# Altium schematic sheet 18 4  第一版.SchDoc
size A1
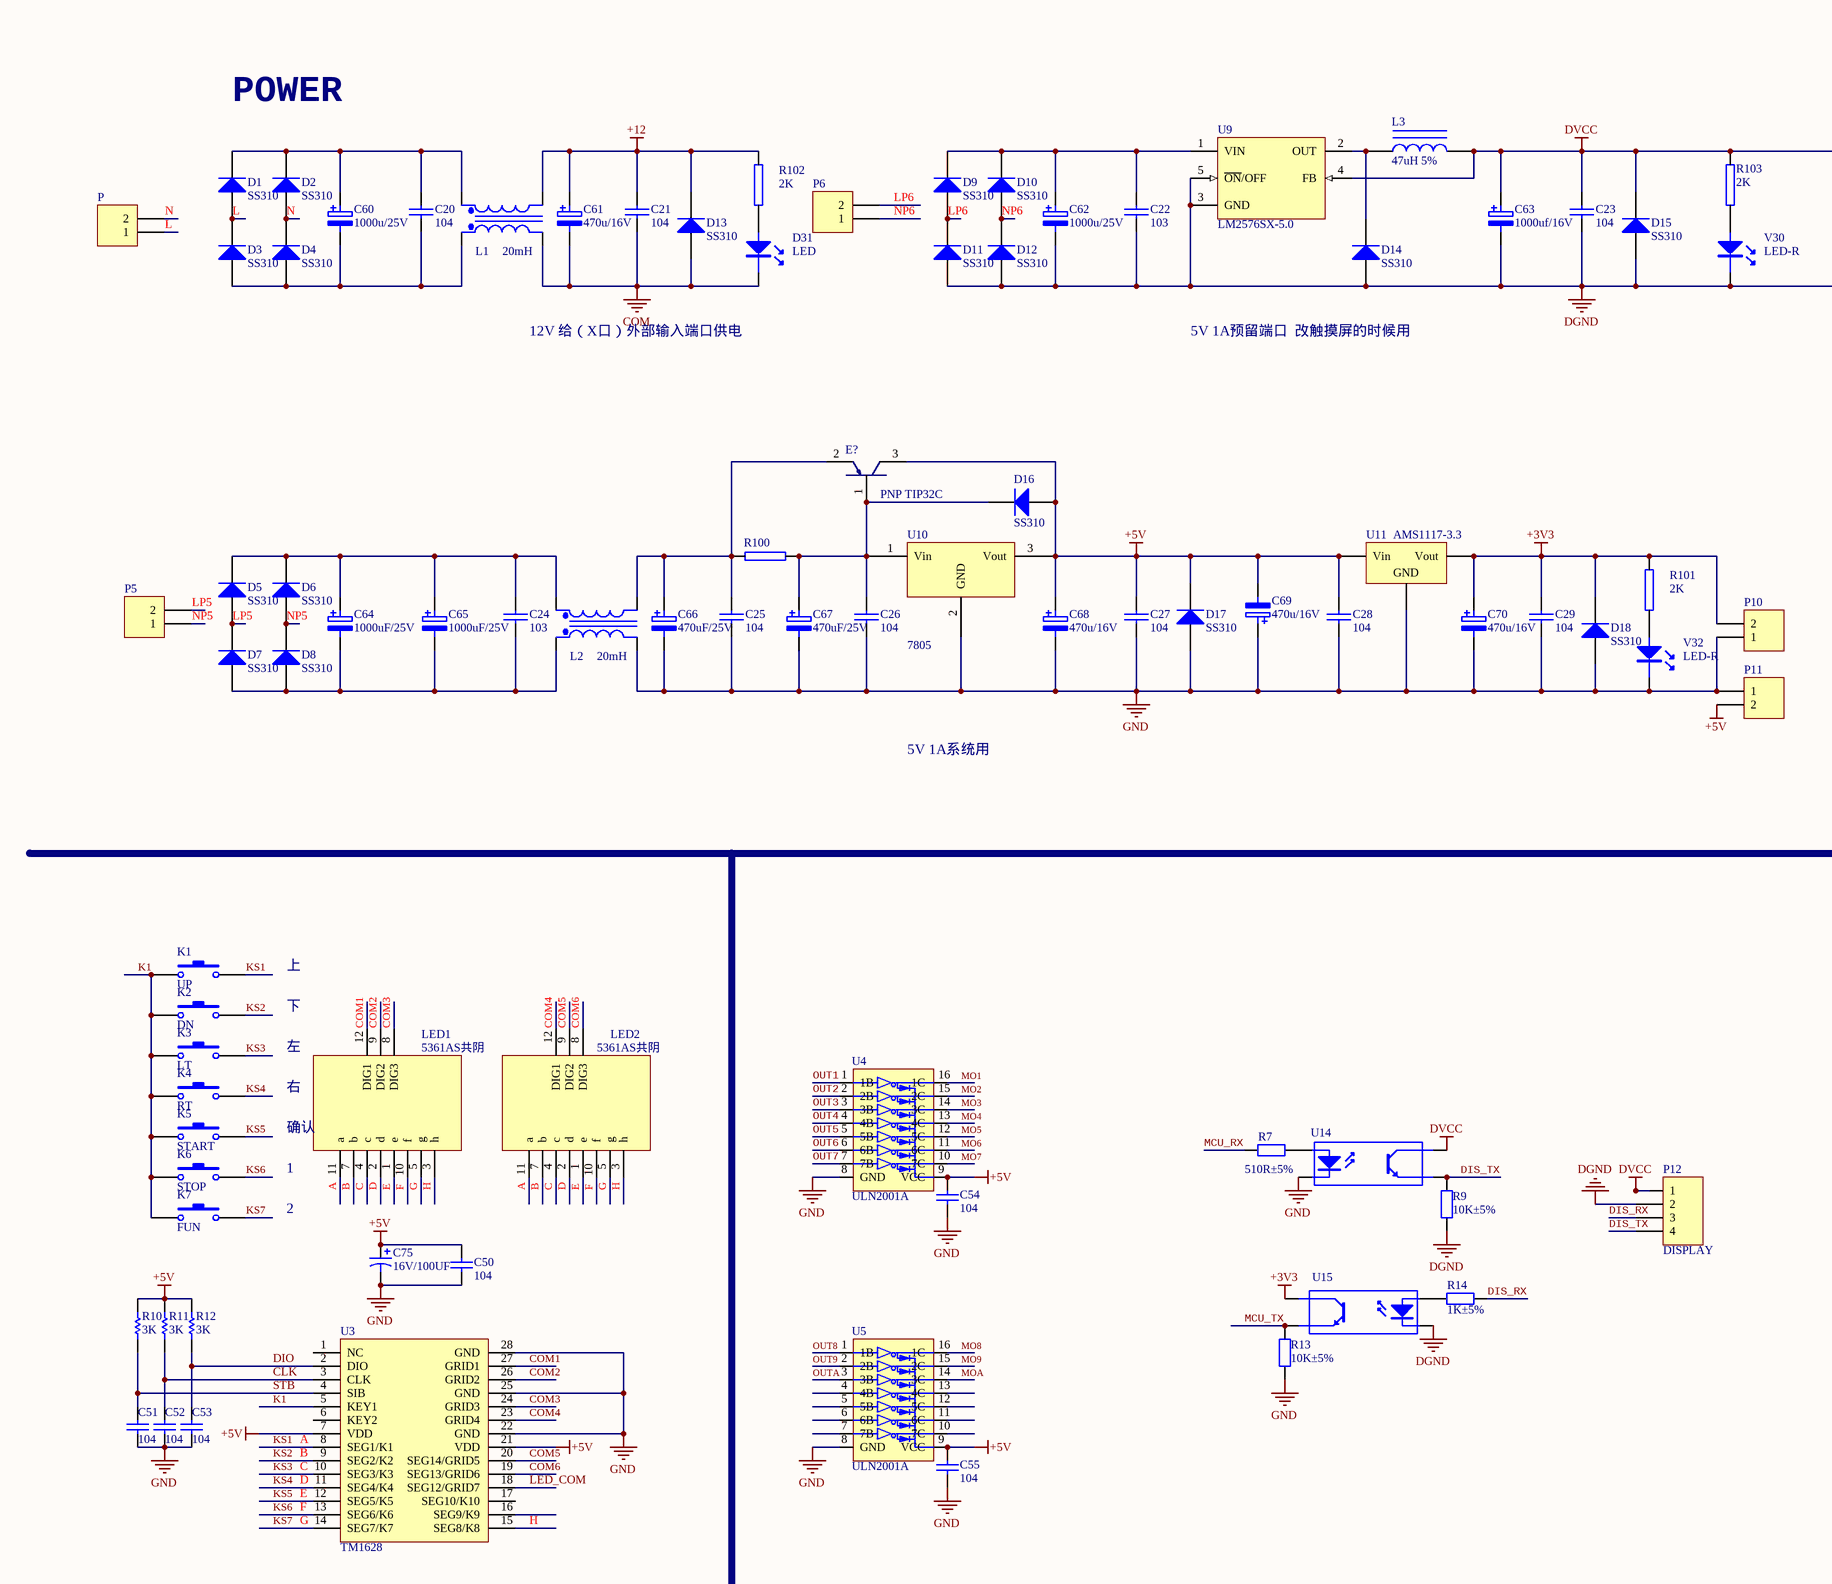
[diagram p0: 18 4  第一版.SchDoc, top left]
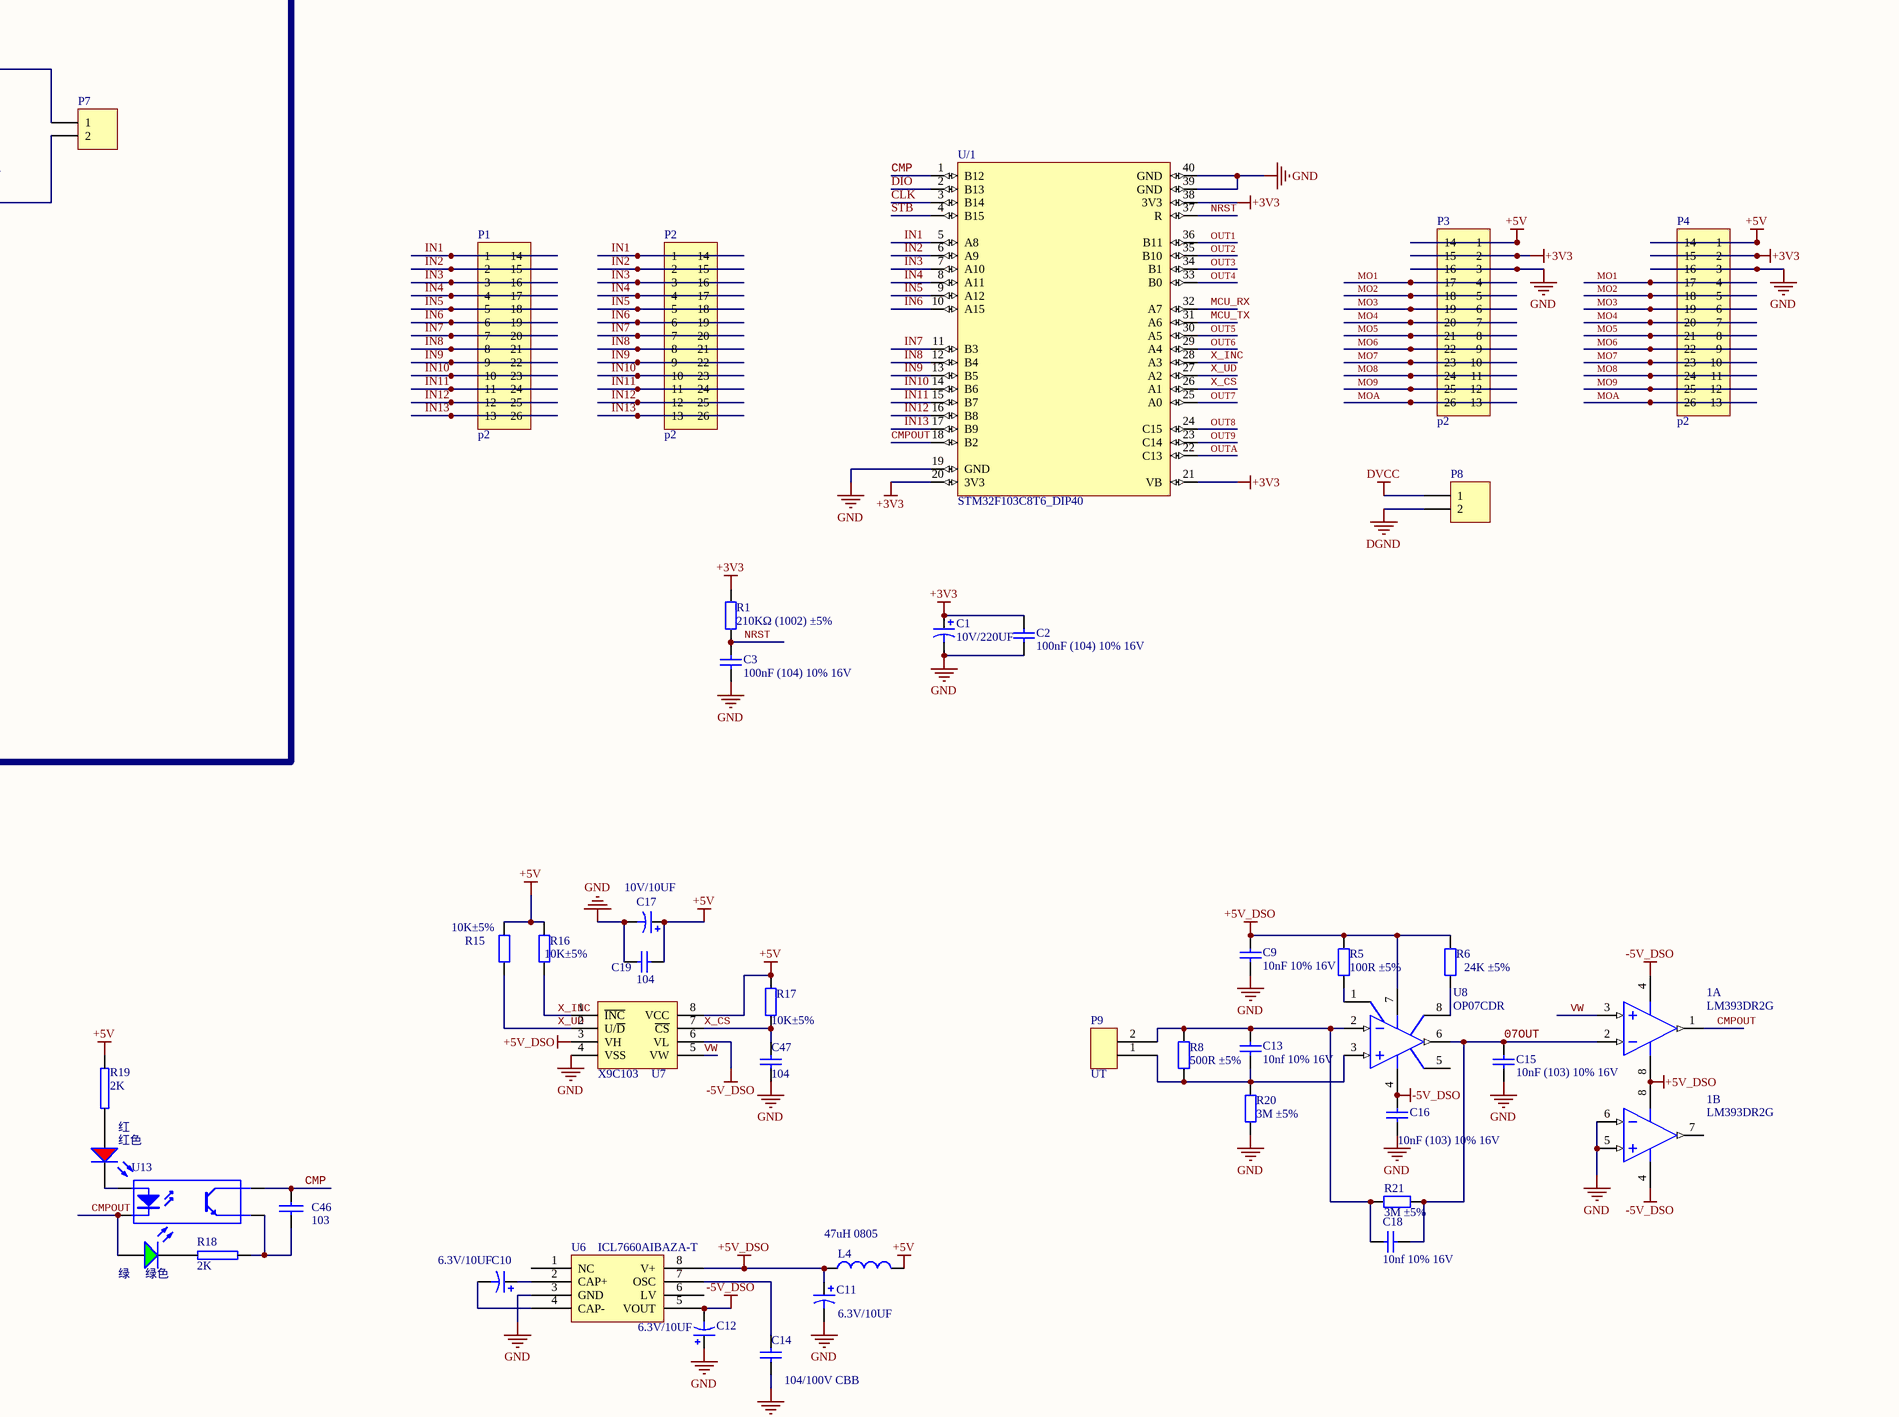
[diagram p1: 18 4  第一版.SchDoc, top right]
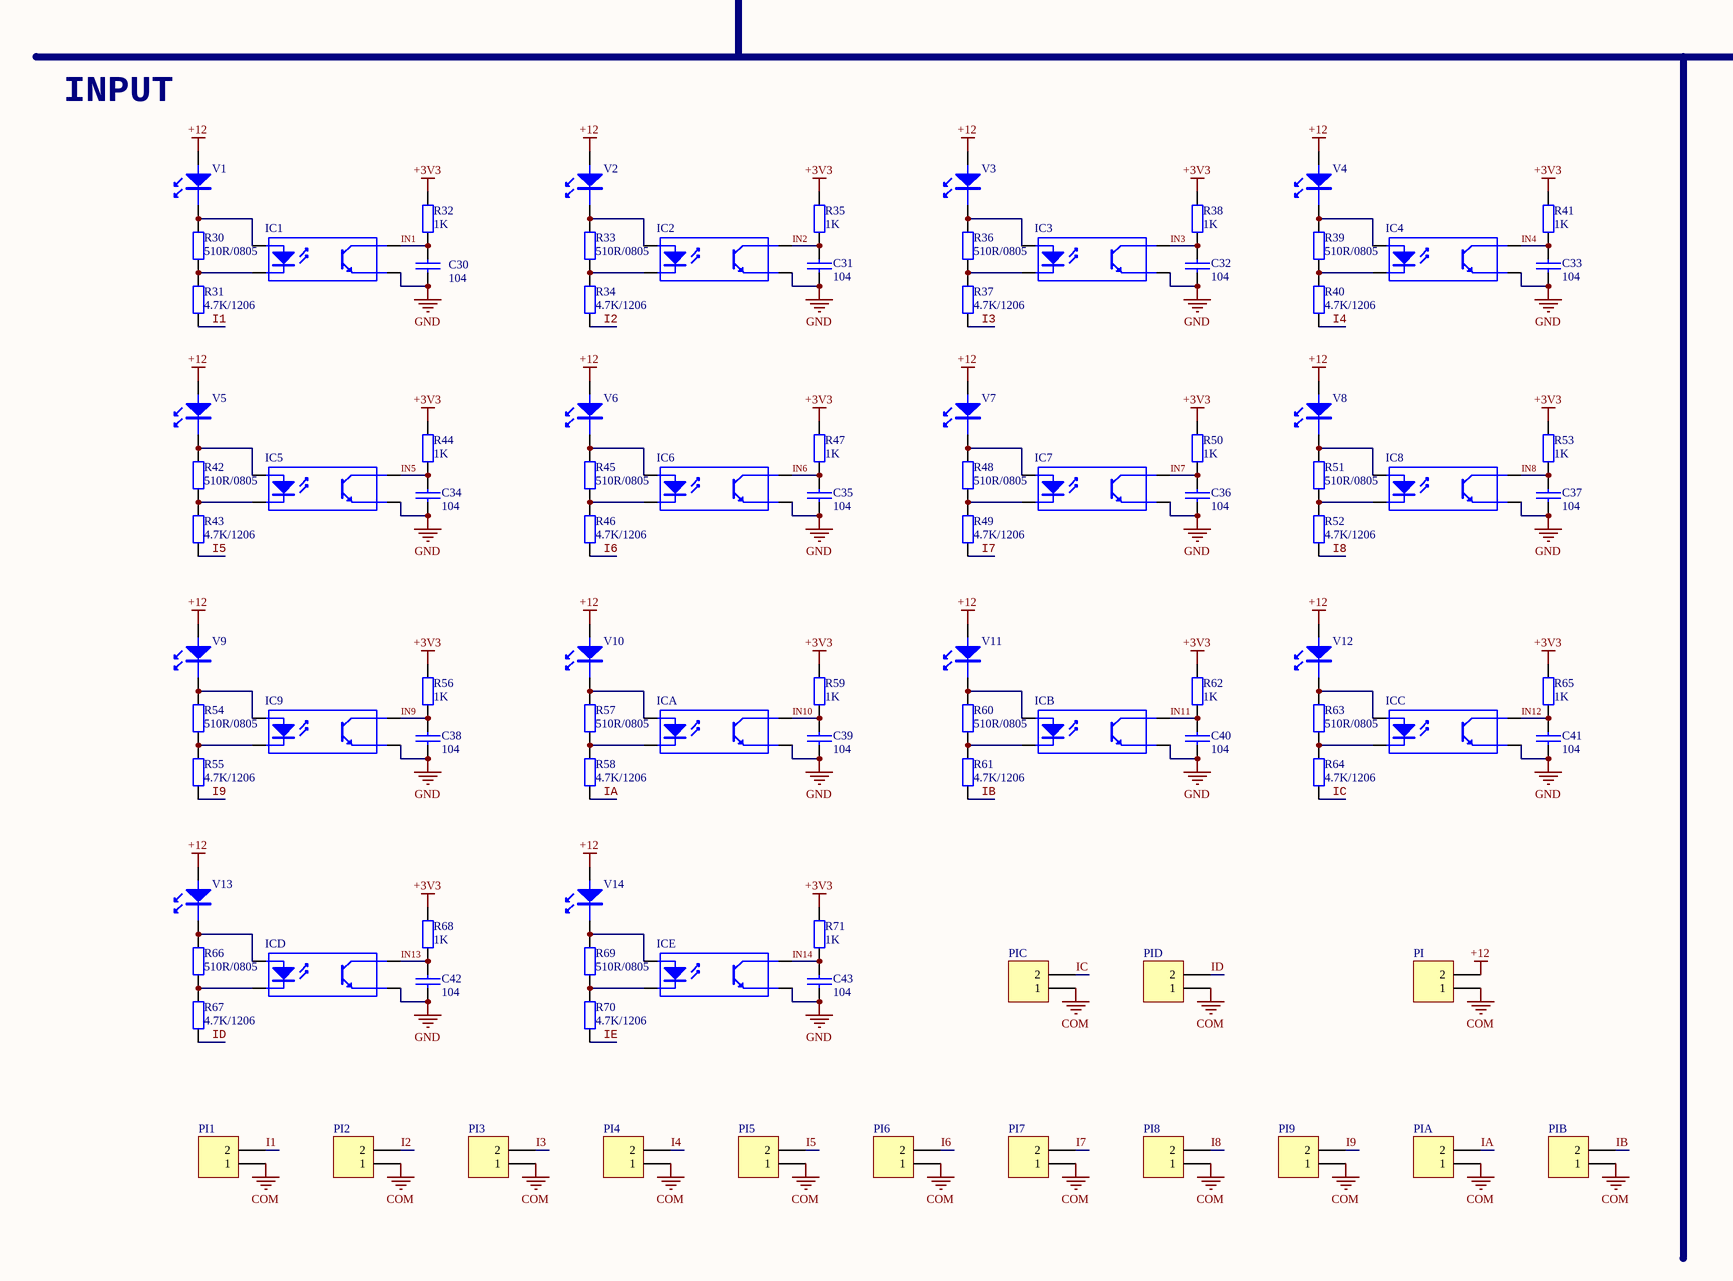
[diagram p2: 18 4  第一版.SchDoc, bottom left]
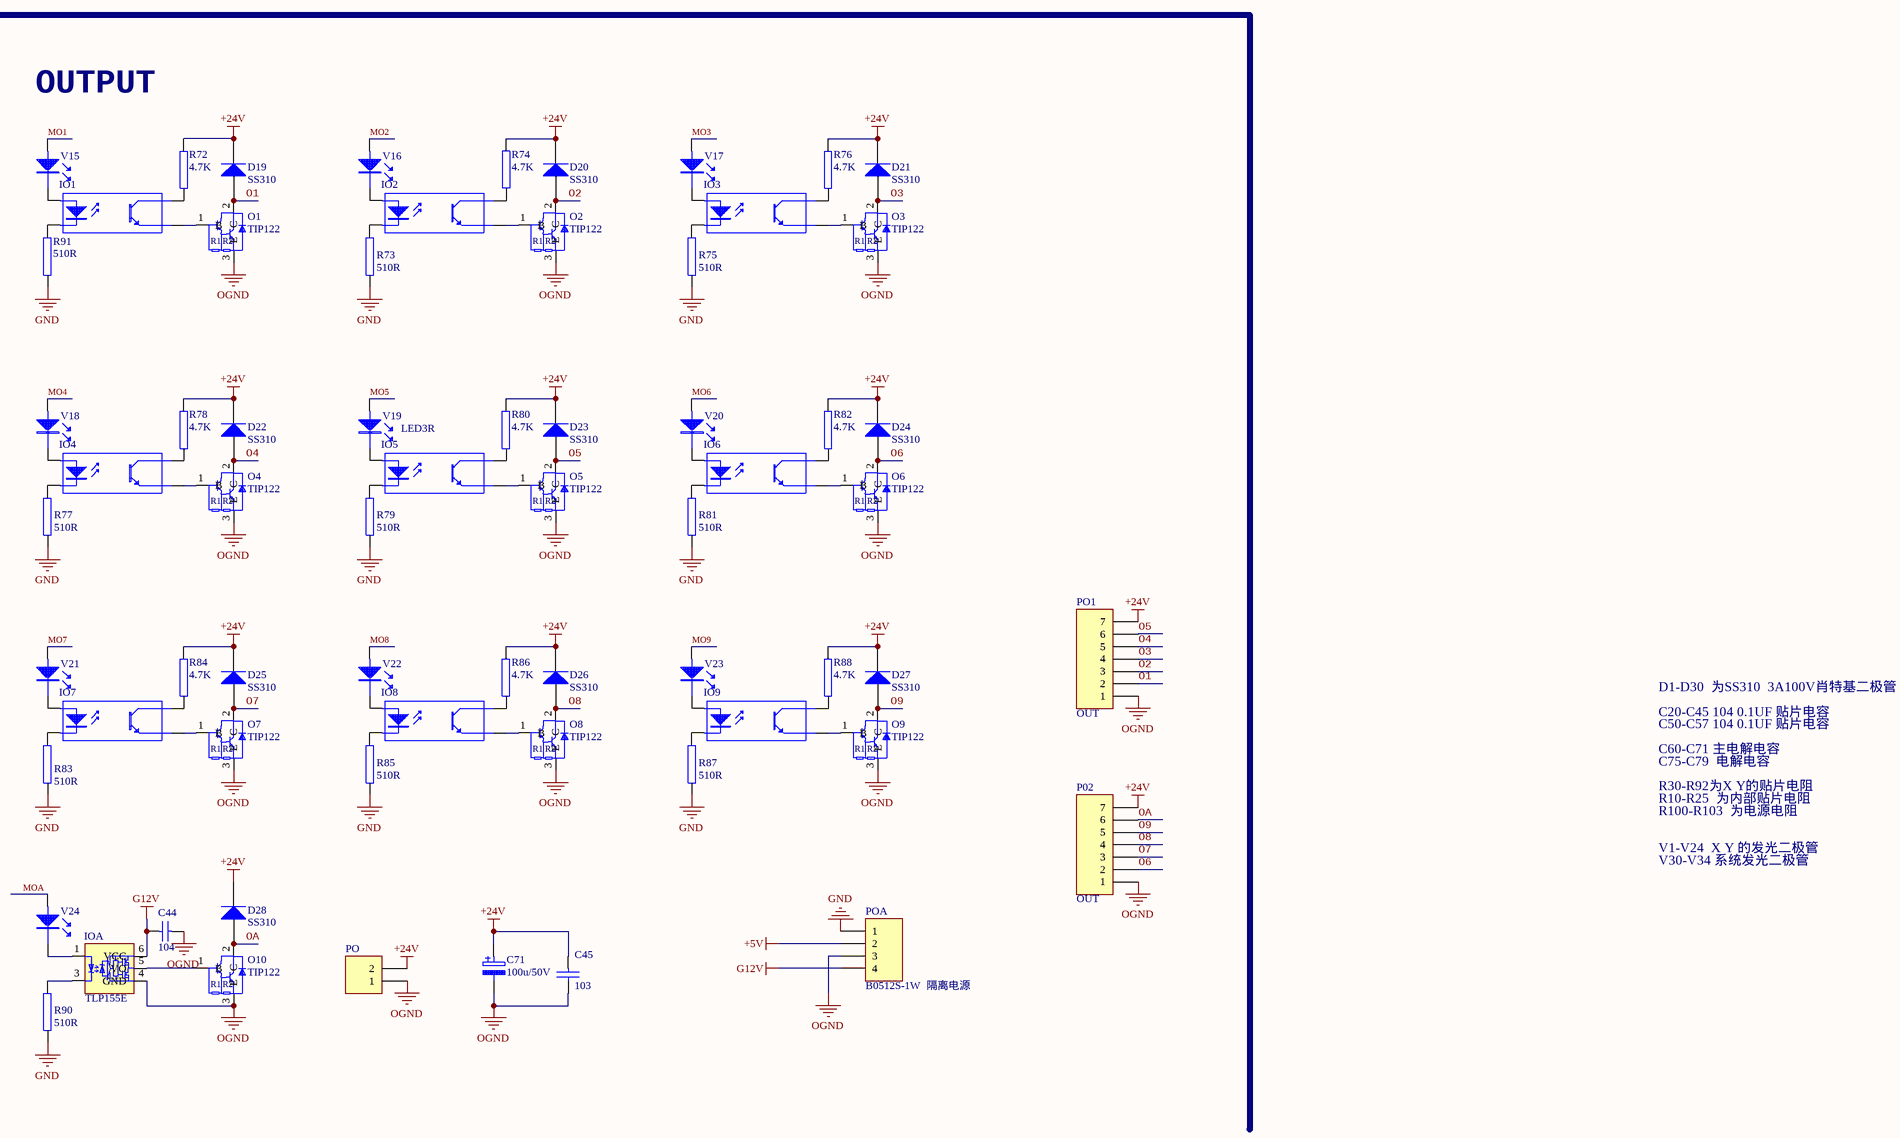
[diagram p3: 18 4  第一版.SchDoc, bottom right]

## Parts
1  LM393DR2G  [LC-SOIC-8_150mil]  (parts A,B of 2)
C1  10V/220UF  [C 5MM]
C2  100nF (104) 10% 16V  [0805-c]
C3  100nF (104) 10% 16V  [0805-c]
C9  10nF 10% 16V  [0805-c]
C10  6.3V/10UF  [C 5MM]
C11  6.3V/10UF  [C 5MM]
C12  6.3V/10UF  [C 5MM]
C13  10nf 10% 16V  [0805-c]
C14  104/100V CBB  [Y电容]
C15  10nF (103) 10% 16V  [0805-c]
C16  10nF (103) 10% 16V  [0805-c]
C17  10V/10UF  [C 5MM]
C18  10nf 10% 16V  [0805-c]
C19  104  [0805-c]
C20  104  [0805-C]
C21  104  [0805-C]
C22  103  [0805-C]
C23  104  [0805-C]
C24  103  [0805-C]
C25  104  [0805-C]
C26  104  [0805-C]
C27  104  [0805-C]
C28  104  [0805-C]
C29  104  [0805-C]
C30  104  [0805-C]
C31  104  [0805-C]
C32  104  [0805-C]
C33  104  [0805-C]
C34  104  [0805-C]
C35  104  [0805-C]
C36  104  [0805-C]
C37  104  [0805-C]
C38  104  [0805-C]
C39  104  [0805-C]
C40  104  [0805-C]
C41  104  [0805-C]
C42  104  [0805-C]
C43  104  [0805-C]
C44  104  [0805-C]
C45  103  [0805-C]
C46  103  [0805-c]
C47  104  [0805-c]
C50  104  [0805-C]
C51  104  [0805-C]
C52  104  [0805-C]
C53  104  [0805-C]
C54  104  [0805-C]
C55  104  [0805-C]
C60  1000u/25V  [C10mm]
C61  470u/16V  [C 8mm]
C62  1000u/25V  [C10mm]
C63  1000uf/16V  [C 8MM]
C64  1000uF/25V  [C10MM]
C65  1000uF/25V  [C10MM]
C66  470uF/25V  [C 8MM]
C67  470uF/25V  [C 8MM]
C68  470u/16V  [C 8MM]
C69  470u/16V  [C 8MM]
C70  470u/16V  [C 8MM]
C71  100u/50V  [C 8MM]
C75  16V/100UF  [C 5MM]
D1  SS310  [DO-214]
D2  SS310  [DO-214]
D3  SS310  [DO-214]
D4  SS310  [DO-214]
D5  SS310  [DO-214]
D6  SS310  [DO-214]
D7  SS310  [DO-214]
D8  SS310  [DO-214]
D9  SS310  [DO-214]
D10  SS310  [DO-214]
D11  SS310  [DO-214]
D12  SS310  [DO-214]
D13  SS310  [DO-214]
D14  SS310  [DO-214]
D15  SS310  [DO-214]
D16  SS310  [DO-214]
D17  SS310  [DO-214]
D18  SS310  [DO-214]
D19  SS310  [DO-214]
D20  SS310  [DO-214]
D21  SS310  [DO-214]
D22  SS310  [DO-214]
D23  SS310  [DO-214]
D24  SS310  [DO-214]
D25  SS310  [DO-214]
D26  SS310  [DO-214]
D27  SS310  [DO-214]
D28  SS310  [DO-214]
D31  LED  [0805LED]
E?  PNP TIP32C  [TO-220-2]
IC1  (no value)  [DIP4]
IC2  (no value)  [DIP4]
IC3  (no value)  [DIP4]
IC4  (no value)  [DIP4]
IC5  (no value)  [DIP4]
IC6  (no value)  [DIP4]
IC7  (no value)  [DIP4]
IC8  (no value)  [DIP4]
IC9  (no value)  [DIP4]
ICA  (no value)  [DIP4]
ICB  (no value)  [DIP4]
ICC  (no value)  [DIP4]
ICD  (no value)  [DIP4]
ICE  (no value)  [DIP4]
IO1  (no value)  [DIP4]
IO2  (no value)  [DIP4]
IO3  (no value)  [DIP4]
IO4  (no value)  [DIP4]
IO5  (no value)  [DIP4]
IO6  (no value)  [DIP4]
IO7  (no value)  [DIP4]
IO8  (no value)  [DIP4]
IO9  (no value)  [DIP4]
IOA  TLP155E  [SOP-6]
K1  UP  [轻触开关 12*12]
K2  DN  [轻触开关 12*12]
K3  LT  [轻触开关 12*12]
K4  RT  [轻触开关 12*12]
K5  START  [轻触开关 12*12]
K6  STOP  [轻触开关 12*12]
K7  FUN  [轻触开关 12*12]
L1  20mH  [UU9.8共模电感]
L2  20mH  [UU9.8共模电感]
L3  47uH 5%  [工字电感 8]
L4  47uH 0805  [LC-1206_L]
LED1  5361AS共阴  [0.5英寸3位数码管]
LED2  5361AS共阴  [0.5英寸3位数码管]
O1  TIP122  [TO-220-2]
O2  TIP122  [TO-220-2]
O3  TIP122  [TO-220-2]
O4  TIP122  [TO-220-2]
O5  TIP122  [TO-220-2]
O6  TIP122  [TO-220-2]
O7  TIP122  [TO-220-2]
O8  TIP122  [TO-220-2]
O9  TIP122  [TO-220-2]
O10  TIP122  [TO-220-2]
P  (no value)  [VH3.96-2P]
P1  p2  [HDR2X13_CEN]
P02  OUT  [VH3.96-6P]
P2  p2  [HDR2X13_CEN]
P3  p2  [HDR2X13_CEN]
P4  p2  [HDR2X13_CEN]
P5  (no value)  [VH3.96-2P]
P6  (no value)  [VH3.96-2P]
P7  (no value)  [HDR1X2]
P8  (no value)  [HDR1X2]
P9  UT  [HEADER 1*2]
P10  (no value)  [HDR1X2]
P11  (no value)  [HDR1X2]
P12  DISPLAY  [HEADER 1*4]
PI  (no value)  [VH3.96-2P]
PI1  (no value)  [VH3.96-2P]
PI2  (no value)  [VH3.96-2P]
PI3  (no value)  [VH3.96-2P]
PI4  (no value)  [VH3.96-2P]
PI5  (no value)  [VH3.96-2P]
PI6  (no value)  [VH3.96-2P]
PI7  (no value)  [VH3.96-2P]
PI8  (no value)  [VH3.96-2P]
PI9  (no value)  [VH3.96-2P]
PIA  (no value)  [VH3.96-2P]
PIB  (no value)  [VH3.96-2P]
PIC  (no value)  [VH3.96-2P]
PID  (no value)  [VH3.96-2P]
PO  (no value)  [VH3.96-2P]
PO1  OUT  [VH3.96-6P]
POA  B0512S-1W  隔离电源  [HDR1X4]
R1  210KΩ (1002) ±5%  [0805-r]
R5  100R ±5%  [0805-r]
R6  24K ±5%  [0805-r]
R7  510R±5%  [0805-r]
R8  500R ±5%  [0805-r]
R9  10K±5%  [0805-r]
R10  3K  [0805-R]
R11  3K  [0805-R]
R12  3K  [0805-R]
R13  10K±5%  [0805-r]
R14  1K±5%  [0805-r]
R15  10K±5%  [0805-R]
R16  10K±5%  [0805-R]
R17  10K±5%  [0805-R]
R18  2K  [0805-R]
R19  2K  [0805-R]
R20  3M ±5%  [0805-r]
R21  3M ±5%  [0805-r]
R30  510R/0805  [0805-R]
R31  4.7K/1206  [1206-R]
R32  1K  [0805-R]
R33  510R/0805  [0805-R]
R34  4.7K/1206  [1206-R]
R35  1K  [0805-R]
R36  510R/0805  [0805-R]
R37  4.7K/1206  [1206-R]
R38  1K  [0805-R]
R39  510R/0805  [0805-R]
R40  4.7K/1206  [1206-R]
R41  1K  [0805-R]
R42  510R/0805  [0805-R]
R43  4.7K/1206  [1206-R]
R44  1K  [0805-R]
R45  510R/0805  [0805-R]
R46  4.7K/1206  [1206-R]
R47  1K  [0805-R]
R48  510R/0805  [0805-R]
R49  4.7K/1206  [1206-R]
R50  1K  [0805-R]
R51  510R/0805  [0805-R]
R52  4.7K/1206  [1206-R]
R53  1K  [0805-R]
R54  510R/0805  [0805-R]
R55  4.7K/1206  [1206-R]
R56  1K  [0805-R]
R57  510R/0805  [0805-R]
R58  4.7K/1206  [1206-R]
R59  1K  [0805-R]
R60  510R/0805  [0805-R]
R61  4.7K/1206  [1206-R]
R62  1K  [0805-R]
R63  510R/0805  [0805-R]
R64  4.7K/1206  [1206-R]
R65  1K  [0805-R]
R66  510R/0805  [0805-R]
R67  4.7K/1206  [1206-R]
R68  1K  [0805-R]
R69  510R/0805  [0805-R]
R70  4.7K/1206  [1206-R]
R71  1K  [0805-R]
R72  4.7K  [0805-R]
R73  510R  [0805-R]
R74  4.7K  [0805-R]
R75  510R  [0805-R]
R76  4.7K  [0805-R]
R77  510R  [0805-R]
R78  4.7K  [0805-R]
R79  510R  [0805-R]
R80  4.7K  [0805-R]
R81  510R  [0805-R]
R82  4.7K  [0805-R]
R83  510R  [0805-R]
R84  4.7K  [0805-R]
R85  510R  [0805-R]
R86  4.7K  [0805-R]
R87  510R  [0805-R]
R88  4.7K  [0805-R]
R90  510R  [0805-R]
R91  510R  [0805-R]
R100  (no value)  [2W]
R101  2K  [0805-R]
R102  2K  [0805-r]
R103  2K  [0805-R]
U3  TM1628  [SOP-28]
U4  ULN2001A  [SOP-16]
U5  ULN2001A  [SOP-16]
U6  ICL7660AIBAZA-T  [LC-SOIC-8_150mil]
U7  X9C103  [LC-SOIC-8_150mil]
U8  OP07CDR  [LC-SOIC-8_150mil]
U9  LM2576SX-5.0  [LC-TO-263-5]
U10  7805  [TO-220-2]
U11  AMS1117-3.3  [LC-SOT-223]
U13  (no value)  [DIP4]
U14  817  [DIP4]  (value not drawn)
U15  817  [DIP4]  (value not drawn)
U/1  STM32F103C8T6_DIP40  [STM32F103C8T6]
V1  (no value)  [0805LED]
V2  (no value)  [0805LED]
V3  (no value)  [0805LED]
V4  (no value)  [0805LED]
V5  (no value)  [0805LED]
V6  (no value)  [0805LED]
V7  (no value)  [0805LED]
V8  (no value)  [0805LED]
V9  (no value)  [0805LED]
V10  (no value)  [0805LED]
V11  (no value)  [0805LED]
V12  (no value)  [0805LED]
V13  (no value)  [0805LED]
V14  (no value)  [0805LED]
V15  (no value)  [0805LED]
V16  (no value)  [0805LED]
V17  (no value)  [0805LED]
V18  (no value)  [0805LED]
V19  LED3R  [0805LED]
V20  (no value)  [0805LED]
V21  (no value)  [0805LED]
V22  (no value)  [0805LED]
V23  (no value)  [0805LED]
V24  (no value)  [0805LED]
V30  LED-R  [0805LED]
V32  LED-R  [0805LED]
红  红色  [3MM 发光二极管]
绿  绿色  [3MM 发光二极管]

## Nets
+3V3: C1.1 C2.1 C29.2 C70.1 D18.2(K) P3.2 P3.15 P4.2 P4.15 P10.2 R1.1 R32.2 R35.2 R38.2 R41.2 R44.2 R47.2 R50.2 R53.2 R56.2 R59.2 R62.2 R65.2 R68.2 R71.2 R101.2 U11.2(Vout) U15.4 U/1.20(3V3) U/1.21(VB) U/1.38(3V3)
+5V: C17.1 C19.2 C27.1 C28.2 C50.2 C54.2 C55.2 C68.1 C69.2 C75.1 D16.1(A) D17.2(K) E?.3 L4.2 P3.1 P3.14 P4.1 P4.14 P11.2 POA.2 R10.2 R11.2 R12.2 R15.2 R16.2 R17.2 R19.2 U3.7(VDD) U3.21(VDD) U4.9(VCC) U5.9(VCC) U7.8(VCC) U10.3(Vout) U11.3(Vin)
+5V_DSO: 1.8(V+) C9.2 C11.1 L4.1 R5.2 R6.2 U6.8(V+) U7.3(VH) U8.7(V+)
+12: C21.1 C61.1 D13.2(K) L1.4(Sec-) PI.2 R102.2 V1.A V2.A V3.A V4.A V5.A V6.A V7.A V8.A V9.A V10.A V11.A V12.A V13.A V14.A
+24V: C45.1 C71.1 D19.2(K) D20.2(K) D21.2(K) D22.2(K) D23.2(K) D24.2(K) D25.2(K) D26.2(K) D27.2(K) D28.2(K) P02.7 PO.2 PO1.7 R72.2 R74.1 R76.2 R78.2 R80.2 R82.2 R84.2 R86.2 R88.2
-5V_DSO: 1.4(GND) C12.2 C16.1 U6.5(VOUT) U7.6(VL) U8.4(V-)
COM: C21.2 C61.2 D13.1(A) D31.K L1.2(Pri-) PI.1 PI1.1 PI2.1 PI3.1 PI4.1 PI5.1 PI6.1 PI7.1 PI8.1 PI9.1 PIA.1 PIB.1 PIC.1 PID.1
DGND: C22.2 C23.1 C62.2 C63.2 D11.1(A) D12.1(A) D14.1(A) D15.1(A) P7.2 P8.2 P12.2 R9.1 U9.3(GND) U9.5(~{ON}/OFF) U15.2 V30.K
DVCC: C23.2 C63.1 D15.2(K) L3.2 P7.1 P8.1 P12.1 R103.2 U9.4(FB) U14.4
G12V: C44.2 IOA.6(VCC) POA.4
GND: 1.5(IN+) 1.6(IN-) C1.2 C2.2 C3.2 C9.1 C11.2 C12.1 C14.1 C15.1 C16.2 C17.2 C19.1 C25.2 C26.2 C27.2 C28.1 C29.1 C30.2 C31.2 C32.2 C33.2 C34.2 C35.2 C36.2 C37.2 C38.2 C39.2 C40.1 C41.1 C42.2 C43.1 C47.1 C50.1 C51.2 C52.1 C53.1 C54.1 C55.1 C66.2 C67.2 C68.2 C69.1 C70.2 C75.2 D17.1(A) D18.1(A) IC1.3 IC2.3 IC3.3 IC4.3 IC5.3 IC6.3 IC7.3 IC8.3 IC9.3 ICA.3 ICB.3 ICC.3 ICD.3 ICE.3 L2.2(Pri-) P3.3 P3.16 P4.3 P4.16 P10.1 P11.1 POA.1 R13.2 R20.1 R73.1 R75.1 R77.1 R79.1 R81.1 R83.1 R85.1 R87.1 R90.1 R91.1 U3.22(GND) U3.25(GND) U3.28(GND) U4.8(GND) U5.8(GND) U6.3(GND) U7.4(VSS) U10.2(GND) U11.1(GND) U14.2 U/1.19(GND) U/1.39(GND) U/1.40(GND) V32.K
OGND: C44.1 C45.2 C71.2 IOA.4(GND) O1.3(E) O2.3(E) O3.3(E) O4.3(E) O5.3(E) O6.3(E) O7.3(E) O8.3(E) O9.3(E) O10.3(E) P02.1 PO.1 PO1.1 POA.3
07OUT: 1.2(IN-) C15.2 C18.2 R21.1 U8.6(OUT)
A: K1.2 LED1.11(a) LED2.11(a) U3.8(SEG1/K1)  [also labelled KS1]
B: K2.2 LED1.7(b) LED2.7(b) U3.9(SEG2/K2)  [also labelled KS2]
C: K3.2 LED1.4(c) LED2.4(c) U3.10(SEG3/K3)  [also labelled KS3]
CLK: C52.2 R11.1 U3.3(CLK) U/1.3(B14)
CMP: C46.1 U13.4 U/1.1(B12)
CMPOUT: 1.1(OUT) U13.2 U/1.18(B2) 绿.A
COM1: LED1.12(DIG1) U3.27(GRID1)
COM2: LED1.9(DIG2) U3.26(GRID2)
COM3: LED1.8(DIG3) U3.24(GRID3)
COM4: LED2.12(DIG1) U3.23(GRID4)
COM5: LED2.9(DIG2) U3.20(SEG14/GRID5)
COM6: LED2.8(DIG3) U3.19(SEG13/GRID6)
D: K4.2 LED1.2(d) LED2.2(d) U3.11(SEG4/K4)  [also labelled KS4]
DIO: C53.2 R12.1 U3.2(DIO) U/1.2(B13)
DIS_RX: P12.3 R14.2
DIS_TX: P12.4 R9.2 U14.3
E: K5.2 LED1.1(e) LED2.1(e) U3.12(SEG5/K5)  [also labelled KS5]
F: K6.2 LED1.10(f) LED2.10(f) U3.13(SEG6/K6)  [also labelled KS6]
G: K7.2 LED1.5(g) LED2.5(g) U3.14(SEG7/K7)  [also labelled KS7]
H: LED1.3(h) LED2.3(h) U3.15(SEG8/K8)
I1: PI1.2 R31.1
I2: PI2.2 R34.1
I3: PI3.2 R37.1
I4: PI4.2 R40.1
I5: PI5.2 R43.1
I6: PI6.2 R46.1
I7: PI7.2 R49.1
I8: PI8.2 R52.1
I9: PI9.2 R55.1
IA: PIA.2 R58.1
IB: PIB.2 R61.1
IC: PIC.2 R64.1
ID: PID.2 R67.1
IE: R70.1
IN1: C30.1 IC1.4 P1.1 P1.14 P2.1 P2.14 R32.1 U/1.5(A8)
IN2: C31.1 IC2.4 P1.2 P1.15 P2.2 P2.15 R35.1 U/1.6(A9)
IN3: C32.1 IC3.4 P1.3 P1.16 P2.3 P2.16 R38.1 U/1.7(A10)
IN4: C33.1 IC4.4 P1.4 P1.17 P2.4 P2.17 R41.1 U/1.8(A11)
IN5: C34.1 IC5.4 P1.5 P1.18 P2.5 P2.18 R44.1 U/1.9(A12)
IN6: C35.1 IC6.4 P1.6 P1.19 P2.6 P2.19 R47.1 U/1.10(A15)
IN7: C36.1 IC7.4 P1.7 P1.20 P2.7 P2.20 R50.1 U/1.11(B3)
IN8: C37.1 IC8.4 P1.8 P1.21 P2.8 P2.21 R53.1 U/1.12(B4)
IN9: C38.1 IC9.4 P1.9 P1.22 P2.9 P2.22 R56.1 U/1.13(B5)
IN10: C39.1 ICA.4 P1.10 P1.23 P2.10 P2.23 R59.1 U/1.14(B6)
IN11: C40.2 ICB.4 P1.11 P1.24 P2.11 P2.24 R62.1 U/1.15(B7)
IN12: C41.2 ICC.4 P1.12 P1.25 P2.12 P2.25 R65.1 U/1.16(B8)
IN13: C42.1 ICD.4 P1.13 P1.26 P2.13 P2.26 R68.1 U/1.17(B9)
IN14: C43.2 ICE.4 R71.1
K1: K1.1 K2.1 K3.1 K4.1 K5.1 K6.1 K7.1 U3.5(KEY1)
L: D1.1(A) D3.2(K) P.1
LED_COM: U3.18(SEG12/GRID7)
LP5: D5.1(A) D7.2(K) P5.2
LP6: D9.1(A) D11.2(K) P6.2
MCU_RX: R7.1 U/1.32(A7)
MCU_TX: R13.1 U15.3 U/1.31(A6)
MO1: P3.4 P3.17 P4.4 P4.17 U4.16(1C) V15.A
MO2: P3.5 P3.18 P4.5 P4.18 U4.15(2C) V16.A
MO3: P3.6 P3.19 P4.6 P4.19 U4.14(3C) V17.A
MO4: P3.7 P3.20 P4.7 P4.20 U4.13(4C) V18.A
MO5: P3.8 P3.21 P4.8 P4.21 U4.12(5C) V19.A
MO6: P3.9 P3.22 P4.9 P4.22 U4.11(6C) V20.A
MO7: P3.10 P3.23 P4.10 P4.23 U4.10(7C) V21.A
MO8: P3.11 P3.24 P4.11 P4.24 U5.16(1C) V22.A
MO9: P3.12 P3.25 P4.12 P4.25 U5.15(2C) V23.A
MOA: P3.13 P3.26 P4.13 P4.26 U5.14(3C) V24.A
N: D2.1(A) D4.2(K) P.2
NP5: D6.1(A) D8.2(K) P5.1
NP6: D10.1(A) D12.2(K) P6.1
NRST: C3.1 R1.2 U/1.37(R)
O1: D19.1(A) O1.2(C) PO1.2
O2: D20.1(A) O2.2(C) PO1.3
O3: D21.1(A) O3.2(C) PO1.4
O4: D22.1(A) O4.2(C) PO1.5
O5: D23.1(A) O5.2(C) PO1.6
O6: D24.1(A) O6.2(C) P02.2
O7: D25.1(A) O7.2(C) P02.3
O8: D26.1(A) O8.2(C) P02.4
O9: D27.1(A) O9.2(C) P02.5
OA: D28.1(A) O10.2(C) P02.6
OUT1: U4.1(1B) U/1.36(B11)
OUT2: U4.2(2B) U/1.35(B10)
OUT3: U4.3(3B) U/1.34(B1)
OUT4: U4.4(4B) U/1.33(B0)
OUT5: U4.5(5B) U/1.30(A5)
OUT6: U4.6(6B) U/1.29(A4)
OUT7: U4.7(7B) U/1.25(A0)
OUT8: U5.1(1B) U/1.24(C15)
OUT9: U5.2(2B) U/1.23(C14)
OUTA: U5.3(3B) U/1.22(C13)
STB: C51.1 R10.1 U3.4(SIB) U/1.4(B15)
VW: 1.3(IN+) U7.5(VW)
X_CS: C47.2 R17.1 U7.7(~{CS}) U/1.26(A1)
X_INC: R16.1 U7.1(~{INC}) U/1.28(A3)
X_UD: R15.1 U7.2(U/~{D}) U/1.27(A2)
NetC10_1: C10.1 U6.2(CAP+)
NetC10_2: C10.2 U6.4(CAP-)
NetC13_1: C13.1 C18.1 P9.2 R8.1 R21.2 U8.2(IN-)
NetC13_2: C13.2 P9.1 R8.2 R20.2 U8.3(IN+)
NetC14_2: C14.2 U6.7(OSC)
NetC20_1: C20.1 C60.1 D1.2(K) D2.2(K) L1.3(Sec+)
NetC20_2: C20.2 C60.2 D3.1(A) D4.1(A) L1.1(Pri+)
NetC22_1: C22.1 C62.1 D9.2(K) D10.2(K) U9.1(VIN)
NetC24_1: C24.1 C64.1 C65.1 D5.2(K) D6.2(K) L2.3(Sec+)
NetC24_2: C24.2 C64.2 C65.2 D7.1(A) D8.1(A) L2.1(Pri+)
NetC25_1: C25.1 C66.1 E?.2 L2.4(Sec-) R100.2
NetC26_1: C26.1 C67.1 D16.2(K) E?.1 R100.1 U10.1(Vin)
NetC46_2: C46.2 R18.2 U13.3
NetD14_2: D14.2(K) L3.1 U9.2(OUT)
NetD31_A: D31.A R102.1
NetIC1_1: IC1.1 R30.2 V1.K
NetIC1_2: IC1.2 R30.1 R31.2
NetIC2_1: IC2.1 R33.2 V2.K
NetIC2_2: IC2.2 R33.1 R34.2
NetIC3_1: IC3.1 R36.2 V3.K
NetIC3_2: IC3.2 R36.1 R37.2
NetIC4_1: IC4.1 R39.2 V4.K
NetIC4_2: IC4.2 R39.1 R40.2
NetIC5_1: IC5.1 R42.2 V5.K
NetIC5_2: IC5.2 R42.1 R43.2
NetIC6_1: IC6.1 R45.2 V6.K
NetIC6_2: IC6.2 R45.1 R46.2
NetIC7_1: IC7.1 R48.2 V7.K
NetIC7_2: IC7.2 R48.1 R49.2
NetIC8_1: IC8.1 R51.2 V8.K
NetIC8_2: IC8.2 R51.1 R52.2
NetIC9_1: IC9.1 R54.2 V9.K
NetIC9_2: IC9.2 R54.1 R55.2
NetICA_1: ICA.1 R57.2 V10.K
NetICA_2: ICA.2 R57.1 R58.2
NetICB_1: ICB.1 R60.2 V11.K
NetICB_2: ICB.2 R60.1 R61.2
NetICC_1: ICC.1 R63.2 V12.K
NetICC_2: ICC.2 R63.1 R64.2
NetICD_1: ICD.1 R66.2 V13.K
NetICD_2: ICD.2 R66.1 R67.2
NetICE_1: ICE.1 R69.2 V14.K
NetICE_2: ICE.2 R69.1 R70.2
NetIO1_1: IO1.1 V15.K
NetIO1_2: IO1.2 R91.2
NetIO1_3: IO1.3 O1.1(B)
NetIO1_4: IO1.4 R72.1
NetIO2_1: IO2.1 V16.K
NetIO2_2: IO2.2 R73.2
NetIO2_3: IO2.3 O2.1(B)
NetIO2_4: IO2.4 R74.2
NetIO3_1: IO3.1 V17.K
NetIO3_2: IO3.2 R75.2
NetIO3_3: IO3.3 O3.1(B)
NetIO3_4: IO3.4 R76.1
NetIO4_1: IO4.1 V18.K
NetIO4_2: IO4.2 R77.2
NetIO4_3: IO4.3 O4.1(B)
NetIO4_4: IO4.4 R78.1
NetIO5_1: IO5.1 V19.K
NetIO5_2: IO5.2 R79.2
NetIO5_3: IO5.3 O5.1(B)
NetIO5_4: IO5.4 R80.1
NetIO6_1: IO6.1 V20.K
NetIO6_2: IO6.2 R81.2
NetIO6_3: IO6.3 O6.1(B)
NetIO6_4: IO6.4 R82.1
NetIO7_1: IO7.1 V21.K
NetIO7_2: IO7.2 R83.2
NetIO7_3: IO7.3 O7.1(B)
NetIO7_4: IO7.4 R84.1
NetIO8_1: IO8.1 V22.K
NetIO8_2: IO8.2 R85.2
NetIO8_3: IO8.3 O8.1(B)
NetIO8_4: IO8.4 R86.1
NetIO9_1: IO9.1 V23.K
NetIO9_2: IO9.2 R87.2
NetIO9_3: IO9.3 O9.1(B)
NetIO9_4: IO9.4 R88.1
NetIOA_1: IOA.1 V24.K
NetIOA_3: IOA.3 R90.2
NetIOA_5: IOA.5(VO) O10.1(B)
NetR5_1: R5.1 U8.1(VOSTRIM)
NetR6_1: R6.1 U8.8(VOSTRIM)
NetR7_2: R7.2 U14.1
NetR14_1: R14.1 U15.1
NetR18_1: R18.1 绿.K
NetR19_1: R19.1 红.A
NetR101_1: R101.1 V32.A
NetR103_1: R103.1 V30.A
NetU13_1: U13.1 红.K

Not connected (* = marked no-connect by the designer): 1 7(OUT); U3 1(NC) 6(KEY2) 16(SEG9/K9) 17(SEG10/K10); U5 4(4B) 5(5B) 6(6B) 7(7B) 10(7C) 11(6C) 12(5C) 13(4C); U6 1(NC) 6(LV); U8 5(NC)

## Notes on the sheet
- POWER
- 12V 给（X口）外部输入端口供电
- 5V 1A预留端口  改触摸屏的时候用
- 5V 1A系统用
- 上
- 下
- 左
- 右
- (near LED1) 确认
- 1
- 2
- INPUT
- OUTPUT
- D1-D30  为SS310  3A100V肖特基二极管
- C20-C45 104 0.1UF 贴片电容
- C50-C57 104 0.1UF 贴片电容
- C60-C71 主电解电容
- R30-R92为X Y的贴片电阻
- R10-R25  为内部贴片电阻
- R100-R103  为电源电阻
- C75-C79  电解电容
- V1-V24  X Y 的发光二极管
- V30-V34 系统发光二极管
- (in symbol TIP122) R1; R2

## Library data of the parts
1 = LM393DR2G: 电压比较器; ComponentLink1Description: 供应商链接; ComponentLink1URL: http://www.szlcsc.com/product/details_8432.html; Package: SOIC-8; Supplier: LC; SuppliersPartNumber: C7955
C1 C10-C12 C17 C75 = Cap Pol1: Polarized Capacitor (Radial); Value: 100pF; Published: 8-Jun-2000; LatestRevisionDate: 17-Jul-2002; LatestRevisionNote: Re-released for DXP Platform.; PackageReference: RB7.6-15; Publisher: Altium Limited
C2 C3 C9 C13 C15 C16 C18 = 0402 100nF (104) 10% 16V: 贴片电容; ComponentLink1Description: 供应商链接; ComponentLink1URL: http://www.szlcsc.com/product/details_1877.html; Package: 0402; Supplier: LC; SuppliersPartNumber: C1525
C14 C19 C47 C50-C55 = Cap Semi: Capacitor (Semiconductor SIM Model); Value: 100pF; Published: 8-Jun-2000; LatestRevisionDate: 29-May-2009; LatestRevisionNote: IPC-7351 Footprint Added.; PackageReference: C1206; Publisher: Altium Limited; PackageDescription: Chip Capacitor
C20-C29 C45 C46 = Pro2C.tmp_103_15
C30-C43 = Pro2C.tmp_104_4
C44 = Cap: Capacitor; Value: 100pF; Published: 8-Jun-2000; LatestRevisionDate: 17-Jul-2002; LatestRevisionNote: Re-released for DXP Platform.; PackageReference: RAD-0.3; Publisher: Altium Limited
C60 C62 C64-C67 = Pro2C.tmp_1000u/25V_55
C61 C63 C68-C70 = Pro2C.tmp_470u/16V_31
C71 = Pro2C.tmp_100u/50V_38
D1-D18 = Diode 1N4007: 3A 100V; Published: 8-Jun-2000; LatestRevisionDate: 17-Jul-2002; LatestRevisionNote: Re-released for DXP Platform.; DatasheetVersion: 1998; PackageVersion: Aug-1999; PackageReference: DO-41; Publisher: Altium Limited; Code_JEDEC: DO-204-AL; ComponentLink1Description: Manufacturer Link; ComponentLink1URL: http://www.fairchildsemi.com/; ComponentLink2Description: Datasheet; ComponentLink2URL: http://www.fairchildsemi.com/ds/1N%2F1N4001.pdf
D19-D28 = Diode 1N4007: 1 Amp General Purpose Rectifier; Published: 8-Jun-2000; LatestRevisionDate: 17-Jul-2002; LatestRevisionNote: Re-released for DXP Platform.; DatasheetVersion: 1998; PackageVersion: Aug-1999; PackageReference: DO-41; Publisher: Altium Limited; Code_JEDEC: DO-204-AL; ComponentLink1Description: Manufacturer Link; ComponentLink1URL: http://www.fairchildsemi.com/; ComponentLink2Description: Datasheet; ComponentLink2URL: http://www.fairchildsemi.com/ds/1N%2F1N4001.pdf
D31 V30 V32 = Pro2C.tmp_LED-R_26
E? = PNP
IC1 = Pro2C.tmp_UnNamed_70
IC2 = Pro2C.tmp_UnNamed_67
IC3 = Pro2C.tmp_UnNamed_74
IC4 = Pro2C.tmp_UnNamed_71
IC5 = Pro2C.tmp_UnNamed_76
IC6-IC9 ICA ICB ICC ICD ICE = Pro2C.tmp_UnNamed_5
IO1 IO7 = Pro2C.tmp_UnNamed_59
IO2 IO8 = Pro2C.tmp_UnNamed_64
IO3 IO9 U14 U15 = Pro2C.tmp_UnNamed_60
IO4 = Pro2C.tmp_UnNamed_63
IO5 = Pro2C.tmp_621_37
IO6 = Pro2C.tmp_UnNamed_24
IOA = TLP701
K1-K7 = SW-PB: Switch; Published: 24-Mar-1999; LatestRevisionDate: 17-Jul-2002; LatestRevisionNote: Re-released for DXP Platform.; PackageReference: SPST-2; Publisher: Altium Limited
L1 = Trans Cupl: 价格在0.6; Published: 8-Jun-2000; LatestRevisionDate: 17-Jul-2002; LatestRevisionNote: Re-released for DXP Platform.; PackageReference: TRF_4; Publisher: Altium Limited
L2 = Trans Cupl: Transformer (Coupled Inductor Model); Published: 8-Jun-2000; LatestRevisionDate: 17-Jul-2002; LatestRevisionNote: Re-released for DXP Platform.; PackageReference: TRF_4; Publisher: Altium Limited
L3 = 0402 27nH 5%: 贴片电感; ComponentLink1Description: 供应商链接; ComponentLink1URL: http://www.szlcsc.com/product/details_19533.html; Package: 0402; Supplier: LC; SuppliersPartNumber: C18830
L4 = Inductor: Code_IEC: 1005; Value: 10mH; Published: 8-Jun-2000; LatestRevisionDate: 29-May-2009; LatestRevisionNote: IPC-7351 Footprint Added.; PackageReference: 0402-A; Publisher: Altium Limited; PackageDescription: Chip Inductor; Code_JEITA: 0402
LED1 LED2 = 三位数码管
O1-O10 = TIP122: R1=8K  R2=0.12K
P P5-P8 P10 P11 PI PI1-PI9 PIA PIB PIC PID PO = Header 2: Header, 2-Pin; LatestRevisionDate: 17-Jul-2002; LatestRevisionNote: Re-released for DXP Platform.; Publisher: Altium Limited
P1-P4 = Header 13X2A: Header, 13-Pin, Dual row; LatestRevisionDate: 17-Jul-2002; LatestRevisionNote: Re-released for DXP Platform.; Publisher: Altium Limited
P02 PO1 = Header 7: Header, 7-Pin; LatestRevisionDate: 17-Jul-2002; LatestRevisionNote: Re-released for DXP Platform.; Publisher: Altium Limited
P9 = Pro2C.tmp_*_16
P12 POA = Header 4: Header, 4-Pin; LatestRevisionDate: 17-Jul-2002; LatestRevisionNote: Re-released for DXP Platform.; Publisher: Altium Limited
R1 R5-R9 R13-R17 R20 R21 = 0805 2.2KΩ (2201) 1%: 贴片电阻; ComponentLink1Description: 供应商链接; ComponentLink1URL: http://www.szlcsc.com/product/details_18208.html; Package: 0805; Supplier: LC; SuppliersPartNumber: C17520
R10-R12 = Res1: Resistor; Value: 1K; Published: 8-Jun-2000; LatestRevisionDate: 17-Jul-2002; LatestRevisionNote: Re-released for DXP Platform.; PackageReference: AXIAL-0.3; Publisher: Altium Limited
R18 R19 R72-R88 R90 R91 R100-R103 = Pro2C.tmp_2K_23
R30 R31 R33 R34 R36 R37 R39 R40 R42 R43 R45 R46 R48 R49 R51 R52 R54 R55 R57 R58 R60 R61 R63 R64 R66 R67 R69 R70 = Res2: Resistor; Value: 1K; Published: 8-Jun-2000; LatestRevisionDate: 17-Jul-2002; LatestRevisionNote: Re-released for DXP Platform.; PackageReference: AXIAL-0.4; Publisher: Altium Limited
R32 R35 R38 R41 R44 R47 R50 R53 R56 R59 R62 R65 R68 R71 = Res2: Resistor; Published: 8-Jun-2000; LatestRevisionDate: 17-Jul-2002; LatestRevisionNote: Re-released for DXP Platform.; PackageReference: AXIAL-0.4; Publisher: Altium Limited; Value: 1K
U4 U5 = ULN2001A: 达林顿晶体管
U6 = ICL7660AIBAZA-T: 电源芯片; ComponentLink1Description: 供应商链接; ComponentLink1URL: http://www.szlcsc.com/product/details_8358.html; Package: SOIC-8_150mil; Supplier: LC; SuppliersPartNumber: C7881
U8 = OP07CDR: 精密运放; ComponentLink1Description: 供应商链接; ComponentLink1URL: http://www.szlcsc.com/product/details_7910.html; Package: SOIC-8; Supplier: LC; SuppliersPartNumber: C7433
U9 = LM2576SX-5.0: DC-DC芯片; ComponentLink1Description: 供应商链接; ComponentLink1URL: http://www.szlcsc.com/product/details_35434.html; Package: TO-263-5; Supplier: LC; SuppliersPartNumber: C34465
U10 = Pro2C.tmp_7805_54
U11 = SOT-223 AMS1117-3.3: 低压差线性稳压(LDO); ComponentLink1Description: 供应商链接; ComponentLink1URL: http://www.szlcsc.com/product/details_6652.html; Package: SOT-223; Supplier: LC; SuppliersPartNumber: C6186
U13 = Pro2C.tmp_UnNamed_33
V1 V2 = Pro2C.tmp_UnNamed_68
V3 = Pro2C.tmp_UnNamed_73
V4 = Pro2C.tmp_UnNamed_72
V5 = Pro2C.tmp_UnNamed_77
V6-V14 = Pro2C.tmp_UnNamed_7
V15 V21 = Pro2C.tmp_UnNamed_39
V16 V22 = Pro2C.tmp_UnNamed_65
V17 V23 V24 = Pro2C.tmp_UnNamed_61
V18 = Pro2C.tmp_UnNamed_62
V19 = Pro2C.tmp_LED3R_34
V20 = Pro2C.tmp_UnNamed_21
红 = 0805 红灯: 发光二极管; ComponentLink1Description: 供应商链接; ComponentLink1URL: http://www.szlcsc.com/product/details_2668.html; Package: 0805; Supplier: LC; SuppliersPartNumber: C2295
绿 = 0805 翠绿: 发光二极管; ComponentLink1Description: 供应商链接; ComponentLink1URL: http://www.szlcsc.com/product/details_2670.html; Package: 0805; Supplier: LC; SuppliersPartNumber: C2297